# Altium schematic sheet Connector.SchDoc
size A
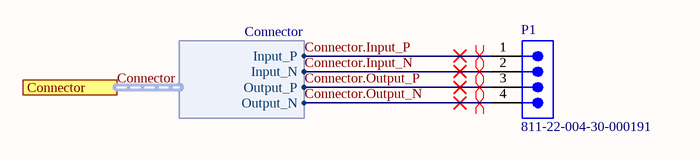
[diagram p0: Connector.SchDoc]

## Parts
P1  811-22-004-30-000191  [MILL-MAX_811-22-004-30-0001910]

## Ports
Connector (harness Connector)

## Harnesses
Connector: Input_P, Input_N, Output_P, Output_N

## Nets
Connector.Input_N: P1.2 ; port Connector.Input_N
Connector.Input_P: P1.1 ; port Connector.Input_P
Connector.Output_N: P1.4 ; port Connector.Output_N
Connector.Output_P: P1.3 ; port Connector.Output_P

## Buses and harness runs
harness Connector = port Connector

## Layout directives
differential pair: Connector.Input_N, Connector.Input_P, Connector.Output_N, Connector.Output_P

## Library data of the parts
P1 = CMP-1650-00001-1: Spring-Loaded Connector, 2.54 Grid Surface Mount, Low Profile Single Row Strip, Vertical, 4-Pin Header, RoHS, Tape and Reel; No. of Positions: 4; Current Rating: 2000 mA; Gender: Male; Pitch: 2.54 mm; No. of Rows: 1; ComponentLink3Description: Package Specification; ComponentLink1Description: Manufacturer URL; Part Number: 811-22-004-30-000191; PartNumber: 811-22-004-30-000191; ComponentLink2URL: http://www.mill-max.com/products/datasheet/sockets/811-22-004-30-000191; ComponentLink2Description: Datasheet; PackageDescription: 4-Pin Header, Body 10.16 x 2.54 mm, Pitch 2.54 mm; Packing: Tape and Reel; ComponentLink1URL: http://www.mill-max.com/; RoHS: TRUE; Orientation: Vertical; ComponentLink3URL: http://www.mill-max.com/assets/pdfs/metric/007M.PDF; Mounting Technology: Surface Mount